# EAGLE design psu (EAGLE 6.1)
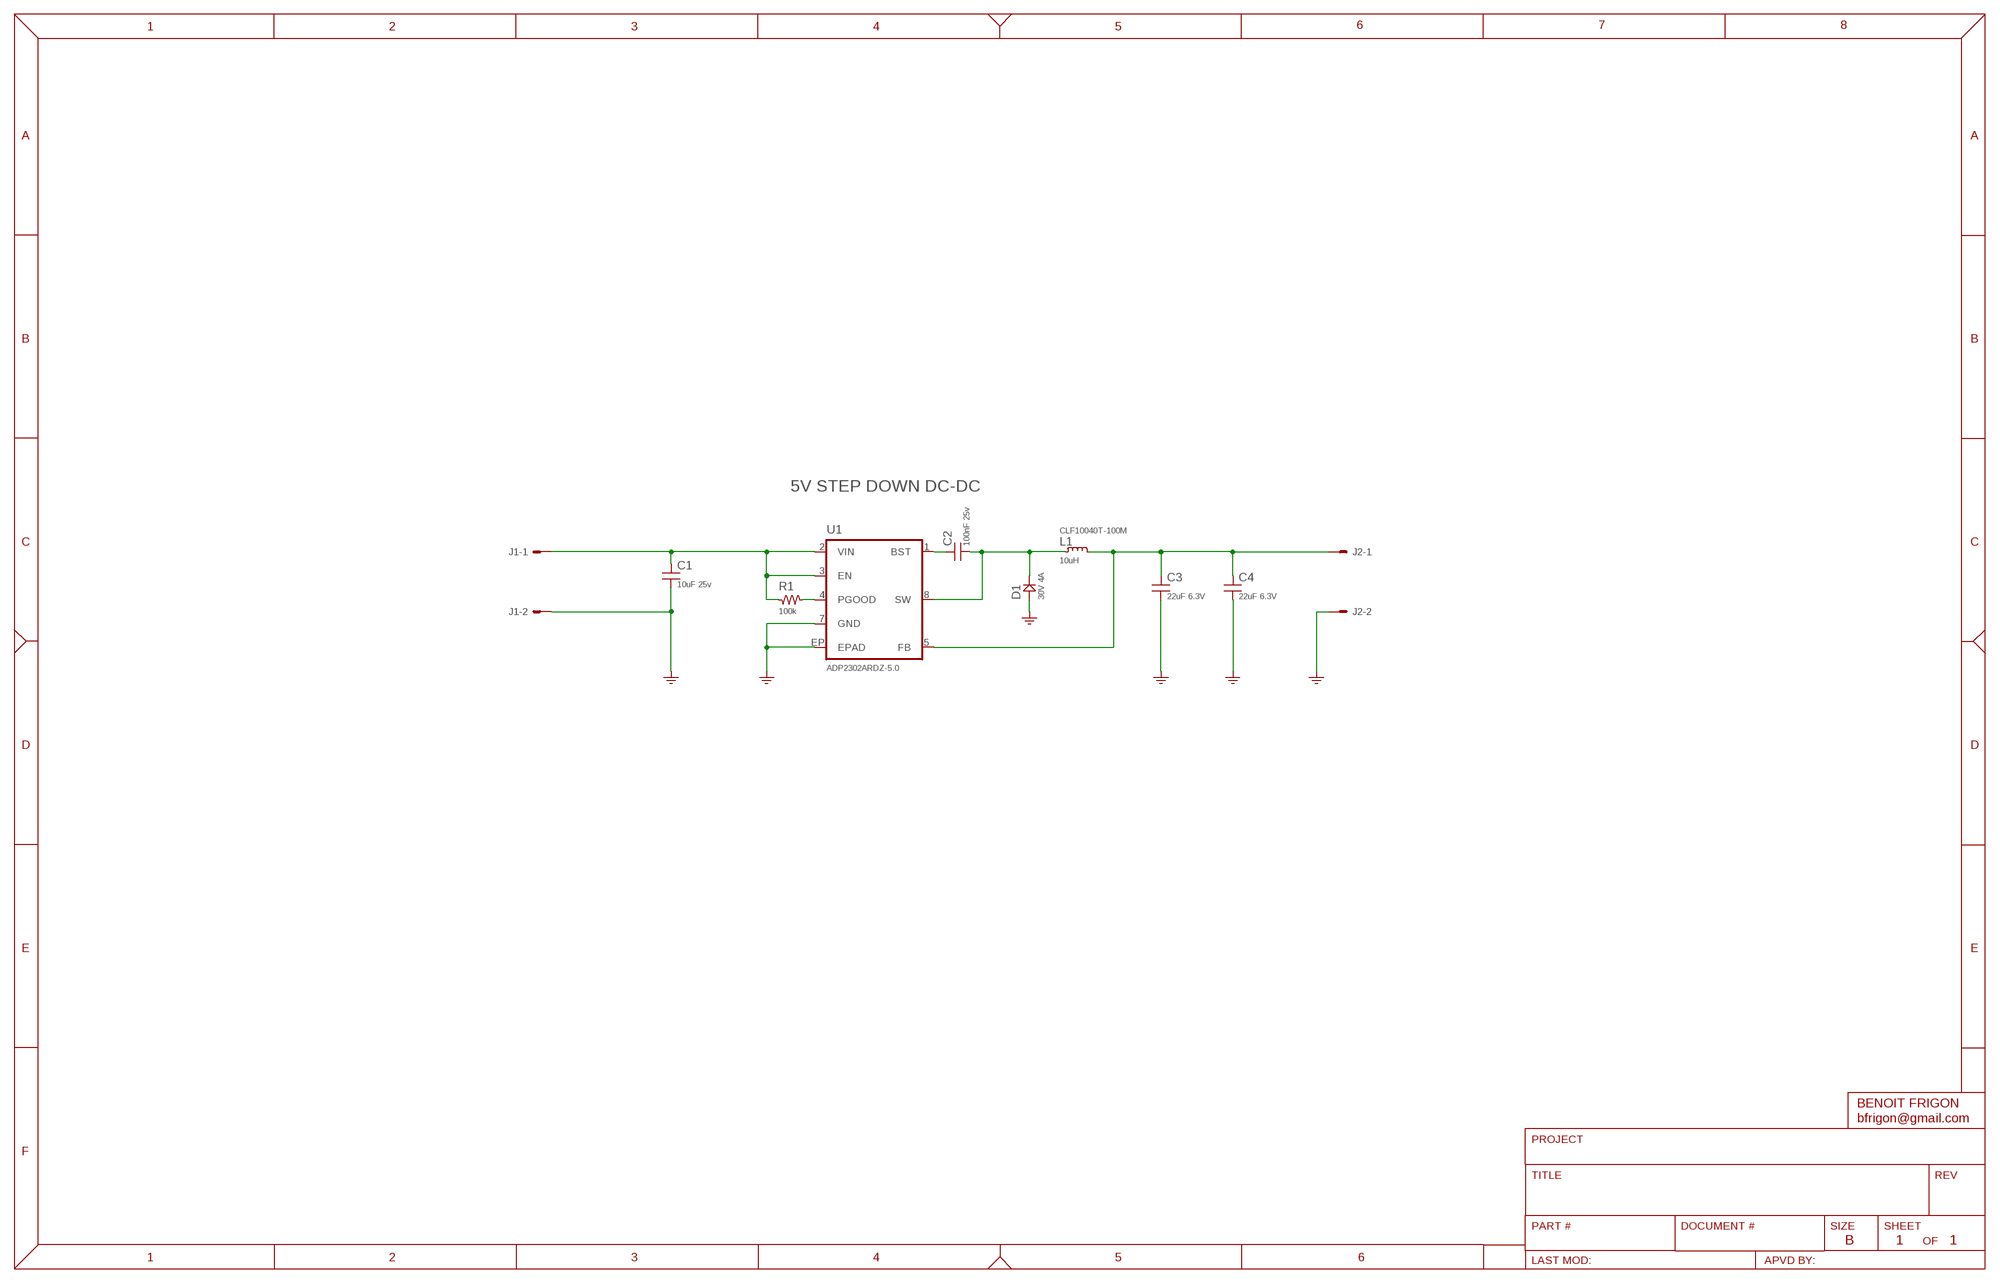
[diagram p0: schematic, sheet 1]

## Parts
C1  10uF 25v  CAP-1206  [SMD_1206]
C2  100nF 25v  CAP-0603  [SMD_0603]
C3  22uF 6.3V  CAP-1206  [SMD_1206]
C4  22uF 6.3V  CAP-1206  [SMD_1206]
D1  30V 4A  DIODE-DO214-AA  [DIODE_DO214-AA]
J1  SNG-100-HEADER-03-HDR-V  [HDR_M_3]
J2  SNG-100-HEADER-03-HDR-V  [HDR_M_3]
L1  10uH  IND-10X10  [IND-10X10]
R1  100k  RES-0603  [SMD_0603]
U1  ADP2302ARDZ-5.0  [SOIC8-EP]

## Nets
5V [Power]: C3.1 C4.1 J2.1 L1.2 U1.5(FB)
GND: C1.2 C3.2 C4.2 D1.A J1.2 J2.2 U1.7(GND) U1.EP(EPAD)
N$3: R1.2 U1.4(PGOOD)
N$11: C2.1 U1.1(BST)
N$33: C2.2 D1.K L1.1 U1.8(SW)
VCC: C1.1 J1.1 R1.1 U1.2(VIN) U1.3(EN)
Unconnected: J1.3 J2.3

## Notes on the sheet
- 5V STEP DOWN DC-DC

## Library data of the parts
C1 C3 C4 = Passive:CAP: Capacitor; DESCRIPTION: {DESCRIPTION} - SMT 1206 - {value}; PACKAGE: SMT 1206
C2 = Passive:CAP: Capacitor; DESCRIPTION: {DESCRIPTION} - SMT 0603 - {value}; PACKAGE: SMT 0603
D1 = Passive:DIODE: Diode
J1 J2 = Connectors:SNG-100-HEADER-03: 3 Pos - Single Row - 2.54mm header
L1 = Passive:IND?*: Inductor; MFG: TDK; PART_NO: CLF10040T-100M
R1 = Passive:RES: Resistor; DESCRIPTION: {DESCRIPTION} - SMT 0603 - {VALUE}; PACKAGE: SMT 0603
U1 = Power:ADP230?: Step-Down Regulator; DESCRIPTION: {DESCRIPTION} - 2A, 5V; MFG: Analog Devices

## Net classes
1 Power: width 0.406 mm, drill 0.457 mm, clearance 0.203 mm

## Board
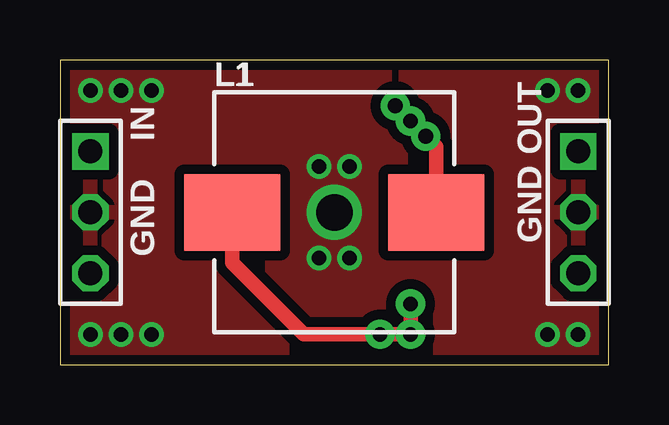
[diagram p1: board, top side]
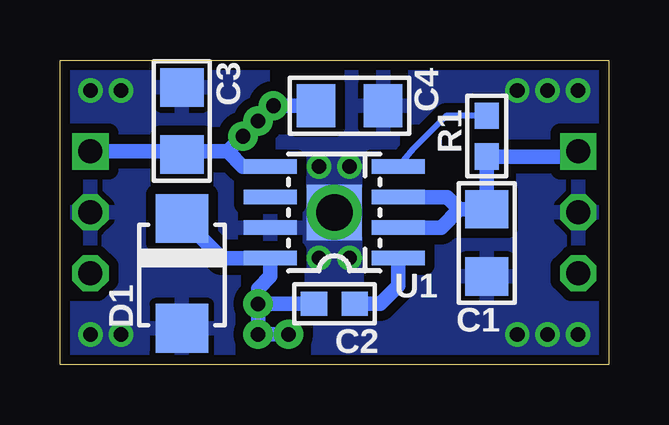
[diagram p2: board, bottom side, seen from below]

Size 22.86 x 12.7 mm. Coordinates in mm from the lower left corner, seen from the top.
Outline: 0,0 22.86,0 22.86,12.7 0,12.7 0,0
Copper layers (1*16): Top 0.035mm / dielectric 1.5mm / Bottom 0.035mm
Design rules: minimum track width 10mil, minimum drill 16mil, track to track 8mil, track to pad 8mil, pad to pad 8mil, via to via 8mil, smd to smd 8mil, copper to edge 16mil, drill to drill 8mil, minimum pad ring 10mil, minimum via ring 8mil, stop-mask expansion 4mil, vias tented up to drill 24mil, thermal gap 10mil

### Footprints (pad centres in the part's own frame; a part is rotated, then mirrored left to right if it is on the bottom)
SMD_1206 = smd 1.6 x 1.8: 1 -1.4,0; 2 1.4,0
SMD_0603 = smd 1.1 x 1: 1 -0.85,0; 2 0.85,0
DIODE_DO214-AA = smd 2.032 x 2.184: A -2.286,0; K 2.286,0
HDR_M_3 = drill 1 square: 1 -2.54,0 | drill 1 octagon: 2 0,0; 3 2.54,0
IND-10X10 = smd 4 x 3.2: 1 -4.246,0; 2 4.246,0
SOIC8-EP = smd 0.6 x 2.2: 1 -1.905,-2.667; 2 -0.635,-2.667; 3 0.635,-2.667; 4 1.905,-2.667; 5 1.905,2.667; 6 0.635,2.667; 7 -0.635,2.667; 8 -1.905,2.667 | smd 2.3 x 2.3: EP 0,0

### Placement (x,y rotation side)
C1  5.08,5.08 270 bottom
C2  11.43,2.54 180 bottom
C3  17.78,10.16 90 bottom
C4  10.79,10.79 0 bottom
D1  17.78,3.81 90 bottom
J1  1.27,6.35 270 top
J2  21.59,6.35 270 top
L1  11.43,6.35 0 top
R1  5.08,9.53 90 bottom
U1  11.43,6.35 90 bottom

### Tracks (layer width: path | path; a pad name or v marks a point on that pad's centre or on a via)
5V  (via drill 0.61 pad 1.22)
  Top 0.61: v13.97,10.79 v15.24,9.53 15.68,9.09 L1.2
  Bottom 0.61: J2.1 17.14,8.89 | 17.14,8.89 15.88,8.89 | U1.5 15.24,8.26 15.88,8.89 | C3.1 17.14,8.89 | 15.88,8.89 v15.24,9.53 v14.61,10.16 v13.97,10.79 C4.1 12.06,10.79
GND  (via drill 0.61, 1.52)
  other vias: 1.27,11.43 2.54,11.43 1.27,1.27 2.54,1.27 20.32,1.27 21.59,1.27 21.59,11.43 20.32,11.43 10.79,8.26 12.06,8.26 12.06,4.45 10.79,4.45 11.43,6.35 3.81,11.43 3.81,1.27
  pour Bottom (isolate 0.406): 0,12.7 22.86,12.7 22.86,0 0,0
  pour Top (isolate 0.406): 0,12.7 22.86,12.7 22.86,0 0,0
N$3
  Bottom 0.254: U1.4 8.13,9.02 6.77,10.38 R1.2
N$11
  Bottom 0.61: U1.1 8.76,3.3 9.53,2.54 C2.1
N$33  (via drill 0.61 pad 1.22)
  Top 0.61: L1.1 7.18,4.25 10.16,1.27 v13.34,1.27 v14.61,1.27 v14.61,2.54
  Bottom 0.61: D1.K 16.13,4.45 U1.8 14.1,3.68 14.61,3.17 v14.61,2.54 | v14.61,2.54 v14.61,1.27 v13.34,1.27 | C2.2 v14.61,2.54
VCC
  Bottom 0.61: 6.22,6.48 C1.1 R1.1 1.27,8.68 J1.1 | 6.22,6.48 6.99,5.71 U1.2 | U1.3 6.72,6.99 6.22,6.48

### Text on the board
tPlace: IN | OUT | GND | GND
_tsilk: L1 | IN | OUT | GND | GND
_bsilk: C3 | C4 | R1 | U1 | C1 | D1 | C2